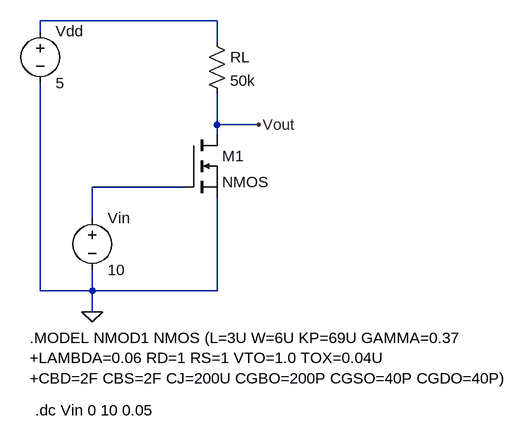
[diagram p0: schematic ee347_prelab2_1a.asc]
ee347_prelab2_1a.asc, the LTspice schematic file:
Version 4
SHEET 1 880 680
WIRE 208 -64 -64 -64
WIRE -64 -48 -64 -64
WIRE 208 -32 208 -64
WIRE 208 96 208 48
WIRE 272 96 208 96
WIRE 208 112 208 96
WIRE 160 192 16 192
WIRE 16 240 16 192
WIRE -64 352 -64 32
WIRE 16 352 16 320
WIRE 16 352 -64 352
WIRE 208 352 208 208
WIRE 208 352 16 352
WIRE 16 384 16 352
FLAG 272 96 Vout
FLAG 16 384 0
SYMBOL voltage 16 224 R0
SYMATTR InstName Vin
SYMATTR Value 10
SYMBOL nmos 160 112 R0
SYMATTR InstName M1
SYMBOL res 192 -48 R0
SYMATTR InstName RL
SYMATTR Value 50k
SYMBOL voltage -64 -64 R0
SYMATTR InstName Vdd
SYMATTR Value 5
TEXT -80 424 Left 2 !.MODEL NMOD1 NMOS (L=3U W=6U KP=69U GAMMA=0.37\n+LAMBDA=0.06 RD=1 RS=1 VTO=1.0 TOX=0.04U\n+CBD=2F CBS=2F CJ=200U CGBO=200P CGSO=40P CGDO=40P)
TEXT -72 536 Left 2 !.dc Vin 0 10 0.05

The netlist it stands for:
* ee347_prelab2_1a.asc
Vin N002 0 10
M1 Vout N002 0 0 NMOS
RL N001 Vout 50k
Vdd N001 0 5
.model NMOS NMOS
.model PMOS PMOS
.lib standard.mos
.MODEL NMOD1 NMOS (L=3U W=6U KP=69U GAMMA=0.37
+LAMBDA=0.06 RD=1 RS=1 VTO=1.0 TOX=0.04U
+CBD=2F CBS=2F CJ=200U CGBO=200P CGSO=40P CGDO=40P)
.dc Vin 0 10 0.05
.backanno
.end